# EAGLE design subway-timetable (EAGLE 7.7.0)
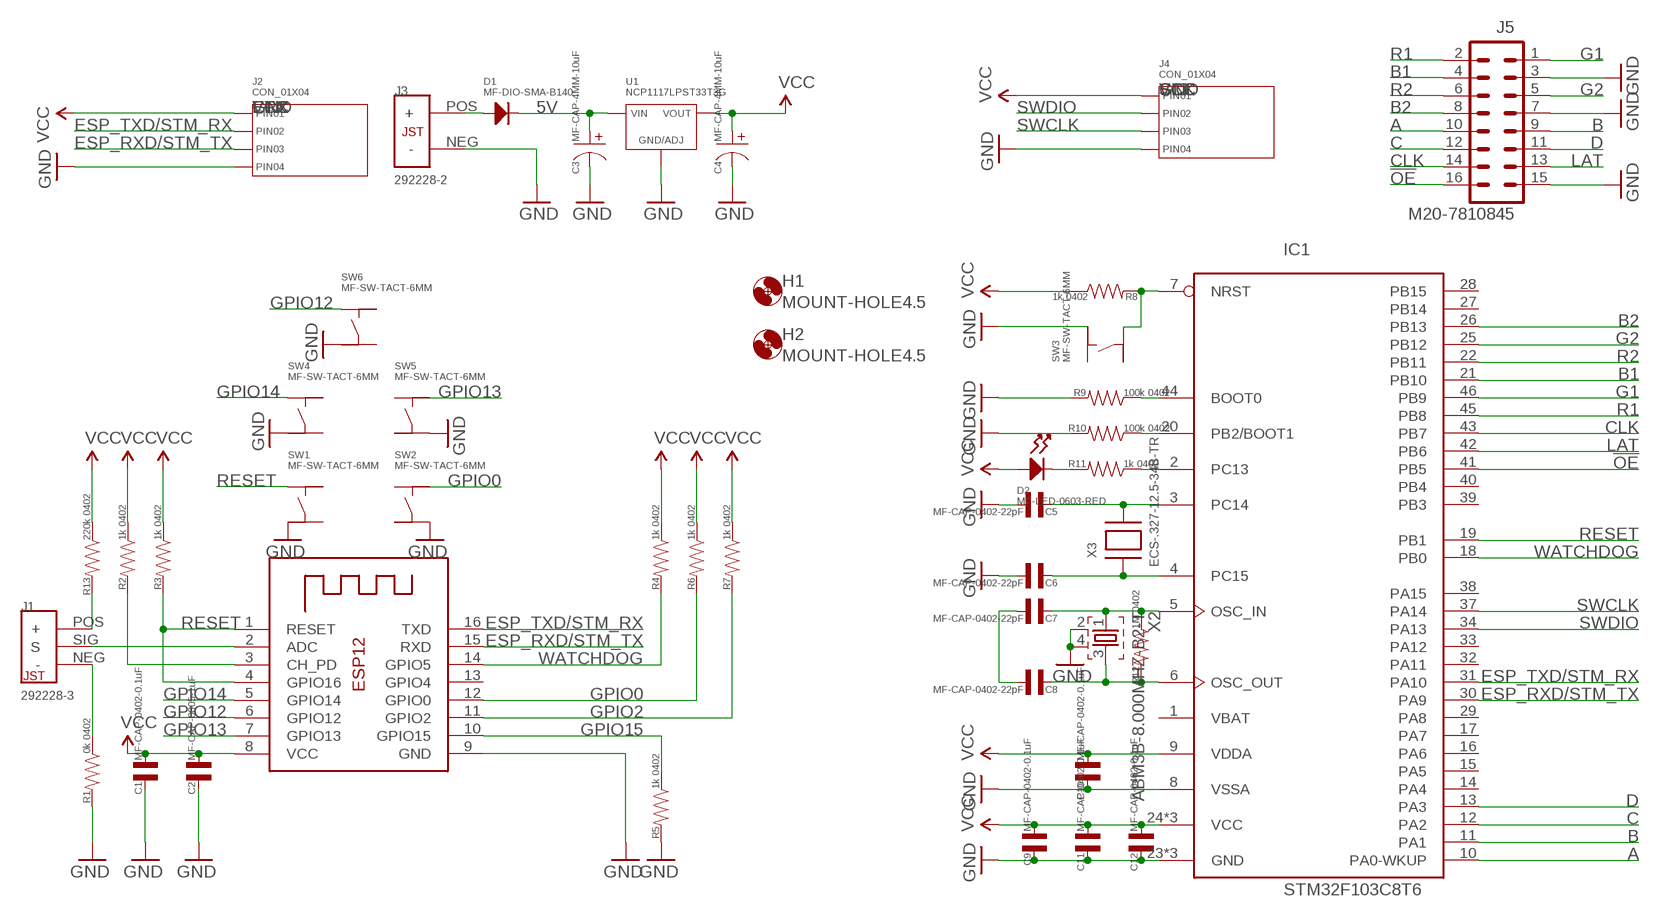
[diagram p0: schematic, sheet 1]

## Parts
C1  MF-CAP-0402-0.1uF  CAPACITOR_NP_0402  [C0402]
C2  MF-CAP-0805-1uF  CAPACITOR_NP_0805  [C0805]
C3  MF-CAP-4MM-10uF  CAPACITOR_P_4MM  [CP4MM]
C4  MF-CAP-4MM-10uF  CAPACITOR_P_4MM  [CP4MM]
C5  MF-CAP-0402-22pF  CAPACITOR_NP_0402  [C0402]
C6  MF-CAP-0402-22pF  CAPACITOR_NP_0402  [C0402]
C7  MF-CAP-0402-22pF  CAPACITOR_NP_0402  [C0402]
C8  MF-CAP-0402-22pF  CAPACITOR_NP_0402  [C0402]
C9  MF-CAP-0402-0.1uF  CAPACITOR_NP_0402  [C0402]
C10  MF-CAP-0402-0.1uF  CAPACITOR_NP_0402  [C0402]
C11  MF-CAP-0402-0.1uF  CAPACITOR_NP_0402  [C0402]
C12  MF-CAP-0402-0.1uF  CAPACITOR_NP_0402  [C0402]
D1  MF-DIO-SMA-B140  DIODES_B140_SMA  [SMA]
D2  MF-LED-0603-RED  LED_SINGLE-0603-RED  [LED0603]
H1  MOUNT-HOLE4.5  [4,5]
H2  MOUNT-HOLE4.5  [4,5]
IC1  STM32F103C8T6  STM32F103C8T  [LQFP48]
J1  292228-3  MINICT-3  [292228-3]
J2  CON_01X04  [PTH_2.54MM_01X04_SPECIAL]
J3  292228-2  MINICT  [292228-2]
J4  CON_01X04  [PTH_2.54MM_01X04_SPECIAL]
J5  M20-7810845  M08X2SMD  [2X8_SMD]
R1  0k 0402  RESISTOR_0402  [R0402]
R2  1k 0402  RESISTOR_0402  [R0402]
R3  1k 0402  RESISTOR_0402  [R0402]
R4  1k 0402  RESISTOR_0402  [R0402]
R5  1k 0402  RESISTOR_0402  [R0402]
R6  1k 0402  RESISTOR_0402  [R0402]
R7  1k 0402  RESISTOR_0402  [R0402]
R8  1k 0402  RESISTOR_0402  [R0402]
R9  100k 0402  RESISTOR_0402  [R0402]
R10  100k 0402  RESISTOR_0402  [R0402]
R11  1k 0402  RESISTOR_0402  [R0402]
R12  1M 0402  RESISTOR_0402  [R0402]
R13  220k 0402  RESISTOR_0402  [R0402]
SW1  MF-SW-TACT-6MM  TACT_6MM  [TACT6MM]
SW2  MF-SW-TACT-6MM  TACT_6MM  [TACT6MM]
SW3  MF-SW-TACT-6MM  TACT_6MM  [TACT6MM]
SW4  MF-SW-TACT-6MM  TACT_6MM  [TACT6MM]
SW5  MF-SW-TACT-6MM  TACT_6MM  [TACT6MM]
SW6  MF-SW-TACT-6MM  TACT_6MM  [TACT6MM]
U1  NCP1117LPST33T3G  [SOT-223-3]
X1  ESP-12  [ESP-12]
X2  ABM3B-8.000MHZ-B2-T  CRYSTALS-GND-LID-CFPX-104  [5.2X3.4-4-PAD]
X3  ECS-.327-12.5-34B-TR  XTAL-3.2X1.5  [XTAL3215]

## Nets
5V: C3.P$1 D1.CATHODE U1.P$4(VIN)
!OE: IC1.41(PB5) J5.16
A: IC1.10(PA0-WKUP) J5.10
B: IC1.11(PA1) J5.9
B1: IC1.21(PB10) J5.4
B2: IC1.26(PB13) J5.8
C: IC1.12(PA2) J5.12
CLK: IC1.43(PB7) J5.14
D: IC1.13(PA3) J5.11
ESP_RXD/STM_TX: IC1.30(PA9) J2.P$3(PIN3) X1.15(RXD)
ESP_TXD/STM_RX: IC1.31(PA10) J2.P$2(PIN2) X1.16(TXD)
G1: IC1.46(PB9) J5.1
G2: IC1.25(PB12) J5.5
GND [power]: C1.P$2 C2.P$2 C3.P$2 C4.P$2 C5.P$1 C6.P$1 C9.P$2 C10.P$2 C11.P$2 C12.P$2 IC1.8(VSSA) IC1.23(GND) IC1.35(GND) IC1.47(GND) J2.P$4(PIN4) J3.NEG(-) J4.P$4(PIN4) J5.3 J5.7 J5.15 R1.P$2 R5.P$2 R9.P$2 R10.P$2 SW1.P$3 SW2.P$4 SW3.P$2 SW4.P$3 SW5.P$4 SW6.P$3 U1.P$2(GND/ADJ) X1.9(GND) X2.2 X2.4
GPIO0: R6.P$2 SW2.P$2 X1.12(GPIO0)
GPIO2: R7.P$2 X1.11(GPIO2)
GPIO12: SW6.P$1 X1.6(GPIO12)
GPIO13: SW5.P$2 X1.7(GPIO13)
GPIO14: SW4.P$1 X1.5(GPIO14)
GPIO15: R5.P$1 X1.10(GPIO15)
LAT: IC1.42(PB6) J5.13
N$1: IC1.20(PB2/BOOT1) R10.P$1
N$2: R2.P$2 X1.3(CH_PD)
N$3: D2.CATHODE R11.P$2
N$4: IC1.7(NRST) R8.P$2 SW3.P$4
N$5: IC1.44(BOOT0) R9.P$1
N$6: J1.SIG(S) X1.2(ADC)
N$7: IC1.2(PC13) R11.P$1
N$8: C5.P$2 IC1.3(PC14) X3.P$2
N$9: C6.P$2 IC1.4(PC15) X3.P$1
N$10: C7.P$2 IC1.5(OSC_IN) R12.P$1 X2.1
N$11: C8.P$2 IC1.6(OSC_OUT) R12.P$2 X2.3
N$12: C7.P$1 C8.P$1
N$13: D1.ANODE J3.POS(+)
N$14: J1.NEG(-) R1.P$1
N$15: J1.POS(+) R13.P$2
R1: IC1.45(PB8) J5.2
R2: IC1.22(PB11) J5.6
RESET: IC1.19(PB1) R3.P$2 SW1.P$1 X1.1(RESET) X1.4(GPIO16)
SWCLK: IC1.37(PA14) J4.P$3(PIN3)
SWDIO: IC1.34(PA13) J4.P$2(PIN2)
VCC [power]: C1.P$1 C2.P$1 C4.P$1 C9.P$1 C10.P$1 C11.P$1 C12.P$1 D2.ANODE IC1.9(VDDA) IC1.24(VCC) IC1.36(VCC) IC1.48(VCC) J2.P$1(PIN1) J4.P$1(PIN1) R2.P$1 R3.P$1 R4.P$1 R6.P$1 R7.P$1 R8.P$1 R13.P$1 U1.P$1(VOUT) U1.P$3(VOUT) X1.8(VCC)
WATCHDOG: IC1.18(PB0) R4.P$2 X1.14(GPIO5)
Unconnected: IC1.14(PA4) IC1.15(PA5) IC1.16(PA6) IC1.17(PA7) IC1.27(PB14) IC1.28(PB15) IC1.29(PA8) IC1.32(PA11) IC1.33(PA12) IC1.38(PA15) IC1.39(PB3) IC1.40(PB4) SW1.P$2 SW1.P$4 SW2.P$1 SW2.P$3 SW3.P$1 SW3.P$3 SW4.P$2 SW4.P$4 SW5.P$1 SW5.P$3 SW6.P$2 SW6.P$4 X1.13(GPIO4)

## Power pins joined to a net without a drawn wire
VBAT: IC1.1(VBAT)

## Library data of the parts
C1 C2 C5-C12 = MF_Passives:CAPACITOR_NP: Library: MF_Passives Description: Device for Non-Polarized Capacitors. Manufacture part number (MPN) can be added via Attributes. Check https://factory.macrofab.com/parts for the house parts list.; POPULATE: 1
C3 C4 = MF_Passives:CAPACITOR_P: Library: MF_Passives Description: Device for Polarized Capacitors. Manufacture part number (MPN), Voltage Rating, and Tolerance can be added via Attributes. Check https://factory.macrofab.com/parts for the house parts list.; POPULATE: 1
D1 = MF_Discrete_Semiconductor:DIODES: Library: MF_Discrete_Semiconductor Description: Device for Single Packaged Diodes.; HOUSEPART: YES; MPN: MF-DIO-SMA-B140; POPULATE: 1; URL: https://factory.macrofab.com/part/MF-DIO-SMA-B140
D2 = MF_LEDs:LED_SINGLE: Library: MF_LEDs Description: Device for Single LED Packages. Manufacture part number (MFG#) can be added via Attributes.; HOUSEPART: YES; MPN: MF-LED-0603-RED; POPULATE: 1; URL: https://factory.macrofab.com/part/MF-LED-0603-RED
H1 H2 = holes:MOUNT-HOLE: MOUNTING HOLE with drill center marker
IC1 = micro-stm_v2:STM32F103C*T: ARM 32-bit Cortex™-M3 CPU 72 MHz maximum frequency 16 to 128 Kbytes of Flash memory 6 to 20 kbytes of SRAM 37 GPIOs 2.0 to 3.6 V application supply
J1 = sonik:MINICT-3
J2 = MF_Connectors:CON_01X04: Library: MF_Connectors Description: Header Connector with 04 Positions and 01 Rows. Use the LABEL Attribute to label the pin on the schematic and PCB. You can remove the attributes on the PCB by using the SMASH function on the part and then deleting the text.; LABEL01: VCC; LABEL02: ETX; LABEL03: ERX; LABEL04: GND
J3 = sonik:MINICT
J4 = MF_Connectors:CON_01X04: Library: MF_Connectors Description: Header Connector with 04 Positions and 01 Rows. Use the LABEL Attribute to label the pin on the schematic and PCB. You can remove the attributes on the PCB by using the SMASH function on the part and then deleting the text.; LABEL01: VCC; LABEL02: SIO; LABEL03: SCK; LABEL04: GND
J5 = SparkFun-Connectors:M08X2: .1" headers, two rows of 8 each
R1-R13 = MF_Passives:RESISTOR: Library: MF_Passives Description: Device for Resistors. Manufacture part number (MPN), Voltage, Tolerance, and Wattage Rating can be added via Attributes. Check https://factory.macrofab.com/parts for the house parts list.; POPULATE: 1
SW1-SW6 = MF_Switches:TACT: Library: MF_Switches Description: Device for Tact Switches. Manufacture part number (MFG#) can be added via Attributes.; HOUSEPART: YES; MPN: MF-SW-TACT-6MM; POPULATE: 1; URL: https://factory.macrofab.com/part/MF-SW-TACT-6MM
U1 = MF_IC_Power:NCP1117LP: Manufacturer Part #: NCP1117LP Manufacturer: ON Semiconductor Description: LDO Voltage Regulators; HOUSEPART: NO; MPN: NCP1117LPST33T3G; POPULATE: 1; URL: http://www.onsemi.com/pub_link/Collateral/NCP1117LP-D.PDF
X1 = adafruit:ESP-12
X2 = IQD-Frequency-Products:CRYSTALS-GND-LID: CRYSTALS WITH CAN GROUNDED
X3 = adafruit:XTAL: Low cost SMT crystals, no capacitors included http://www.ladyada.net/library/eagle

## Net classes
1 power: width 0.305 mm

## Board
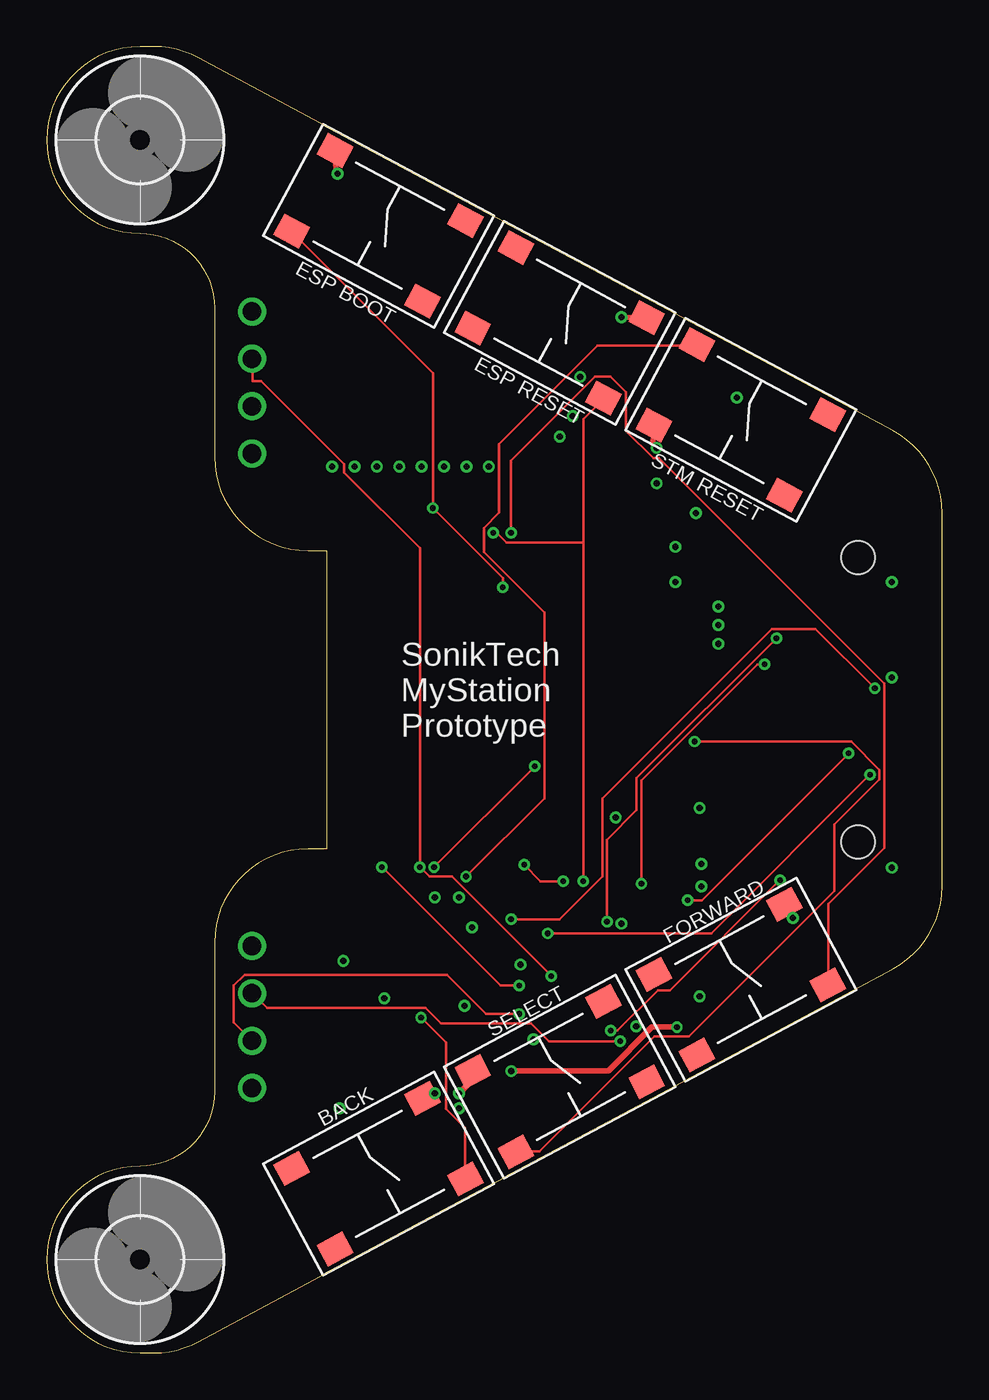
[diagram p1: board, top side]
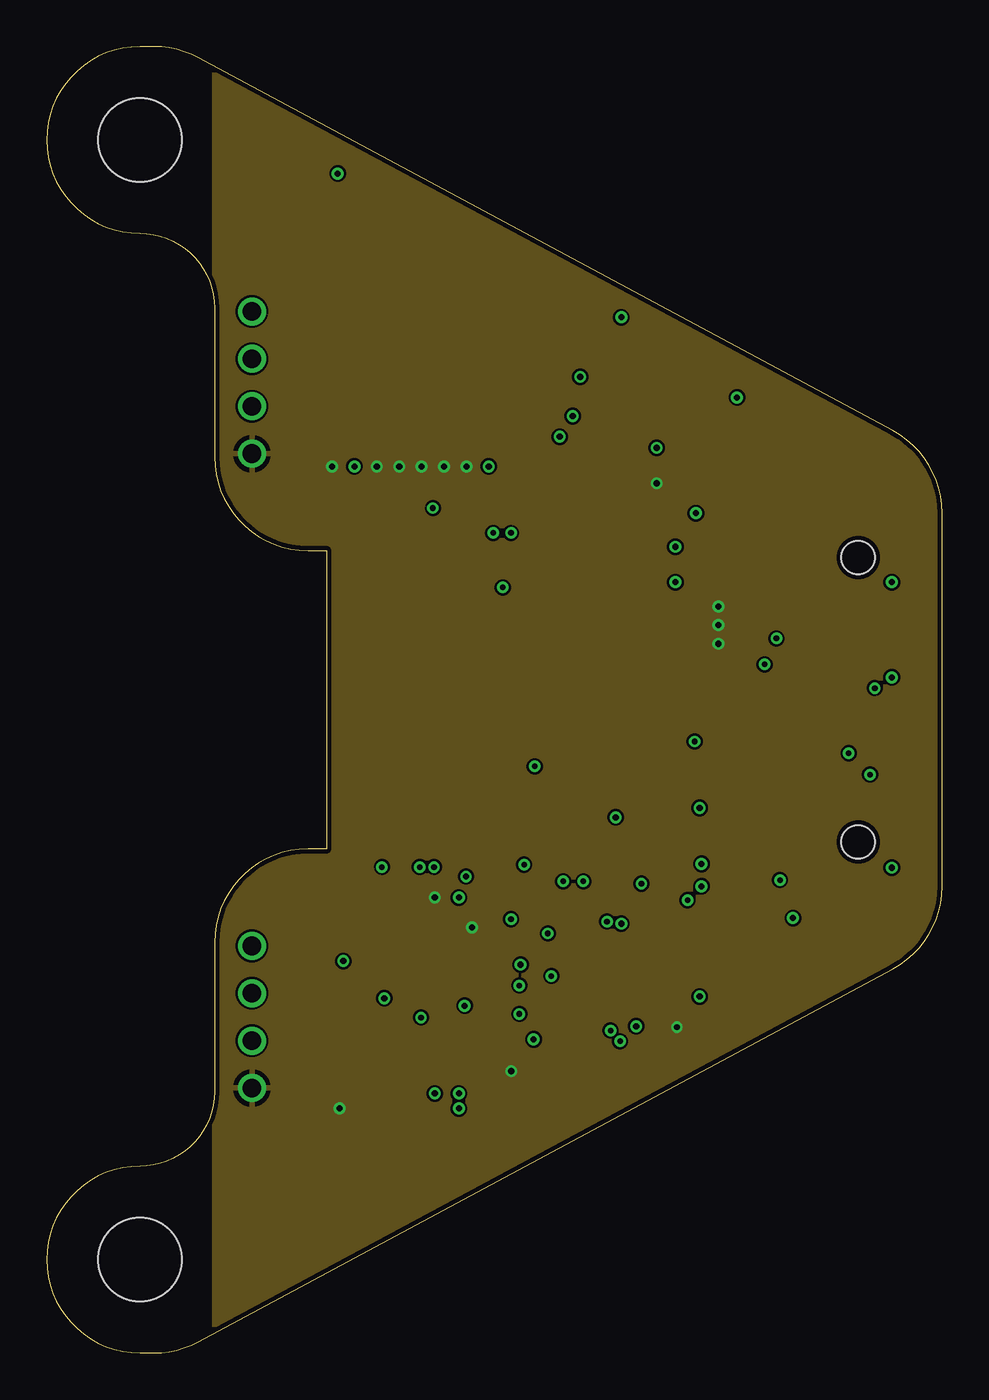
[diagram p2: board, inner layer VCC]
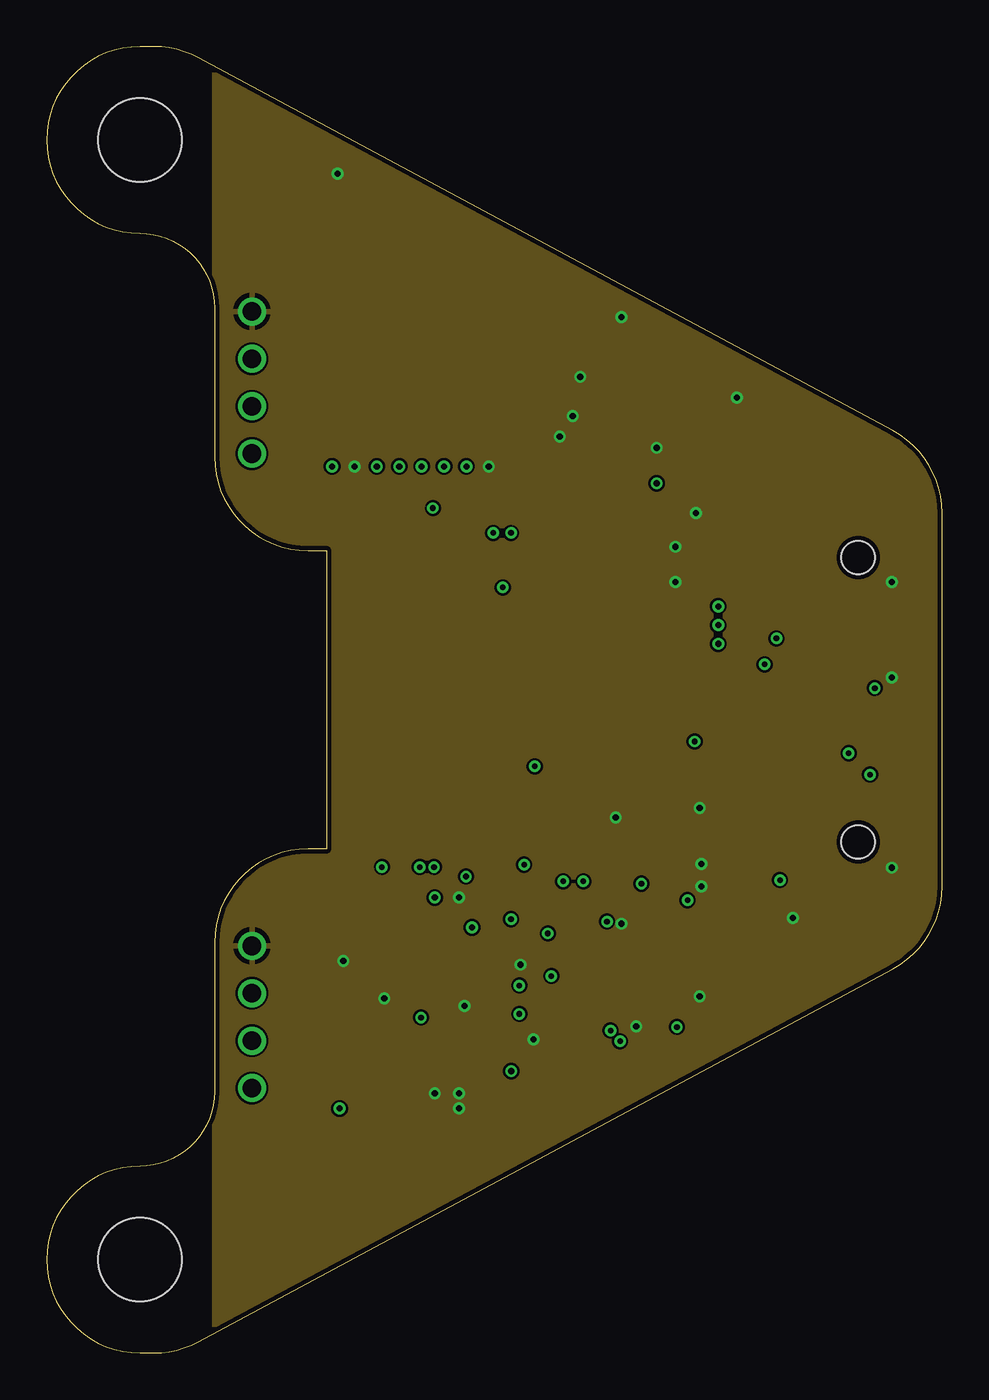
[diagram p3: board, inner layer GND]
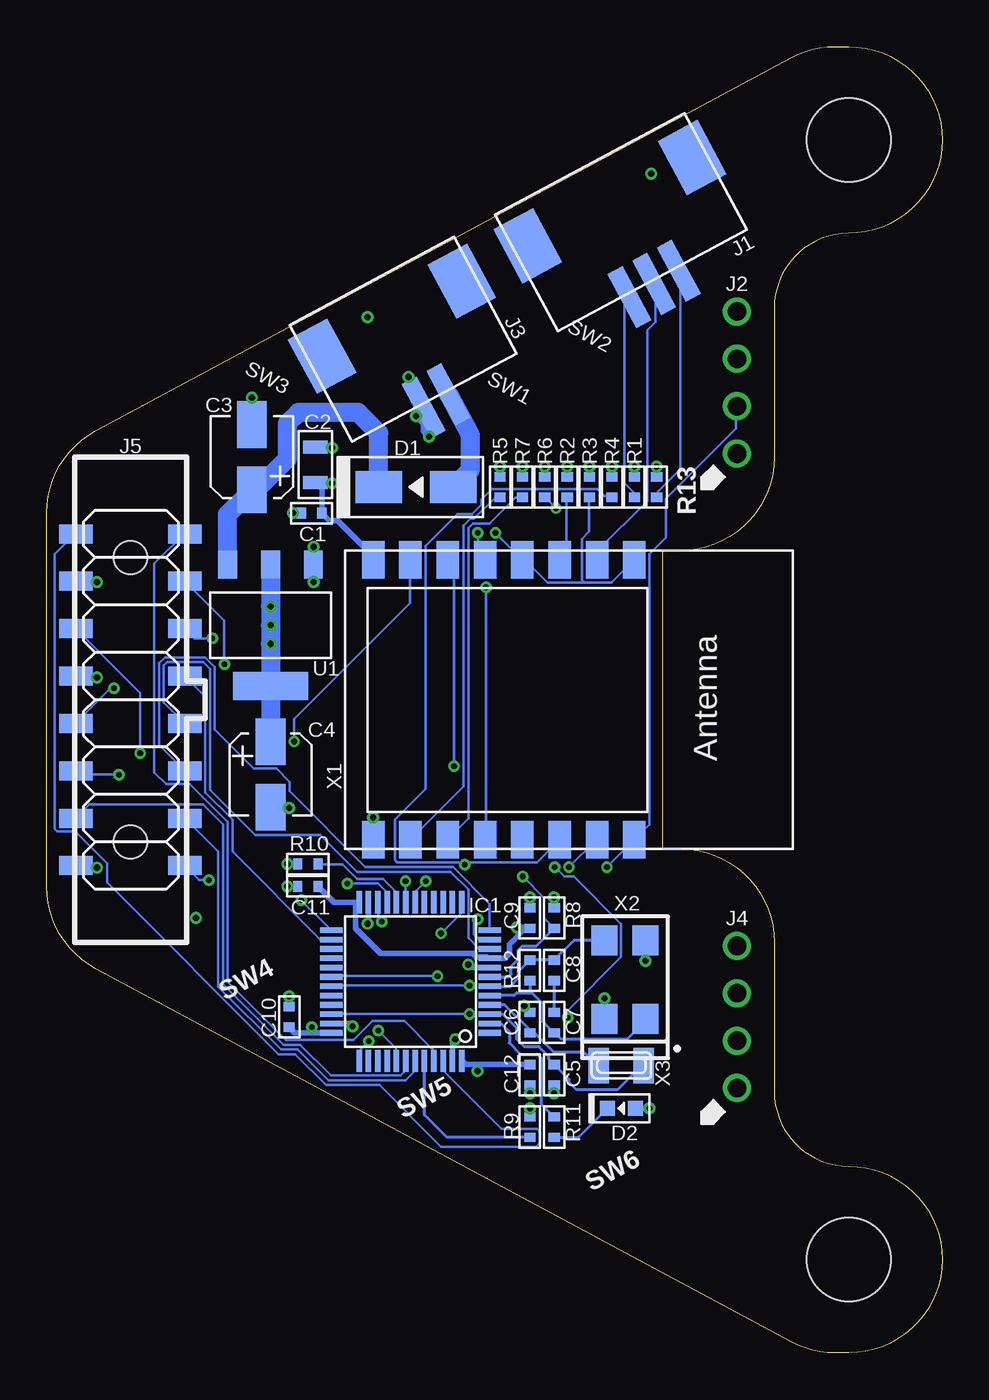
[diagram p4: board, bottom side, seen from below]

Size 48 x 70 mm. Coordinates in mm from the lower left corner, seen from the top.
Outline: 48,24.99 48,45.01 arc62 45.36,49.41 8.11,69.41 arc28 5.74,70 5,70 arc90 0,65 arc90 5,60 arc-90 9,56 9,48 arc90 14,43 15,43 15,27 14,27 arc90 9,22 9,14 arc-90 5,10 arc90 0,5 arc90 5,0 5.74,0 arc28 8.11,0.59 45.36,20.59 arc62 48,24.99
Copper layers (1*2*15*16): Top 0.035mm / dielectric 0.23mm / VCC 0.035mm / dielectric 0.93mm / GND 0.035mm / dielectric 0.23mm / Bottom 0.035mm
Design rules "MF_Standard_4_Layer": minimum track width 5mil, minimum drill 12mil, track to track 5mil, track to pad 5mil, pad to pad 5mil, via to via 5mil, smd to smd 0mil, copper to edge 10mil, drill to drill 10mil, minimum pad ring 6mil, minimum via ring 6mil, stop-mask expansion 2mil, vias tented up to drill 25mil, thermal gap 10mil

### Footprints (pad centres in the part's own frame; a part is rotated, then mirrored left to right if it is on the bottom)
C0402 = smd 0.5 x 0.6: P$1 -0.55,0; P$2 0.55,0
C0805 = smd 0.7 x 1.3: P$1 -0.95,0; P$2 0.95,0
CP4MM = smd 1.6 x 2.5: P$1 0,-1.75; P$2 0,1.75
SMA = smd 2.5 x 1.7: ANODE 2,0; CATHODE -2,0
LED0603 = smd 0.8 x 0.8: ANODE 0.75,0; CATHODE -0.75,0
4,5 = hole 4.5: 0,0
LQFP48 = smd 0.3 x 1.2: 1 -2.75,-4.25; 2 -2.25,-4.25; 3 -1.75,-4.25; 4 -1.25,-4.25; 5 -0.75,-4.25; 6 -0.25,-4.25; 7 0.25,-4.25; 8 0.75,-4.25; 9 1.25,-4.25; 10 1.75,-4.25; 11 2.25,-4.25; 12 2.75,-4.25; 25 2.75,4.25; 26 2.25,4.25; 27 1.75,4.25; 28 1.25,4.25; 29 0.75,4.25; 30 0.25,4.25; 31 -0.25,4.25; 32 -0.75,4.25; 33 -1.25,4.25; 34 -1.75,4.25; 35 -2.25,4.25; 36 -2.75,4.25 | smd 1.2 x 0.3: 13 4.25,-2.75; 14 4.25,-2.25; 15 4.25,-1.75; 16 4.25,-1.25; 17 4.25,-0.75; 18 4.25,-0.25; 19 4.25,0.25; 20 4.25,0.75; 21 4.25,1.25; 22 4.25,1.75; 23 4.25,2.25; 24 4.25,2.75; 37 -4.25,2.75; 38 -4.25,2.25; 39 -4.25,1.75; 40 -4.25,1.25; 41 -4.25,0.75; 42 -4.25,0.25; 43 -4.25,-0.25; 44 -4.25,-0.75; 45 -4.25,-1.25; 46 -4.25,-1.75; 47 -4.25,-2.25; 48 -4.25,-2.75
292228-3 = smd 0.9 x 3.3: NEG 1.5,4; POS -1.5,4; SIG 0,4 | smd 2.4 x 3.3: SLD1 -5,-1; SLD2 5,-1
PTH_2.54MM_01X04_SPECIAL = drill 1: P$1 -3.81,0; P$2 -1.27,0; P$3 1.27,0; P$4 3.81,0
292228-2 = smd 0.9 x 3.3: NEG 0.75,0; POS -0.75,0 | smd 2.4 x 3.3: SLD1 -4.25,-5; SLD2 4.25,-5
2X8_SMD = smd 1.02 x 1.78: 1 -8.89,-2.932; 2 -8.89,2.91; 3 -6.35,-2.932; 4 -6.35,2.91; 5 -3.81,-2.932; 6 -3.81,2.91; 7 -1.27,-2.932; 8 -1.27,2.91; 9 1.27,-2.932; 10 1.27,2.91; 11 3.81,-2.932; 12 3.81,2.91; 13 6.35,-2.932; 14 6.35,2.91; 15 8.89,-2.932; 16 8.89,2.91 | hole 1.8: -7.62,0; 7.62,0
R0402 = smd 0.5 x 0.6: P$1 -0.55,0; P$2 0.55,0
TACT6MM = smd 1.55 x 1.3: P$1 -3.975,2.45; P$2 3.975,2.45; P$3 -3.975,-2.45; P$4 3.975,-2.45
SOT-223-3 = smd 1.5 x 4: P$1 3.25,0 | smd 1.5 x 1: P$2 -3.25,2.3; P$3 -3.25,0; P$4 -3.25,-2.3
ESP-12 = smd 2 x 1.2: 1 -7.5,4.5; 2 -7.5,2.5; 3 -7.5,0.5; 4 -7.5,-1.5; 5 -7.5,-3.5; 6 -7.5,-5.5; 7 -7.5,-7.5; 8 -7.5,-9.5; 9 7.5,-9.5; 10 7.5,-7.5; 11 7.5,-5.5; 12 7.5,-3.5; 13 7.5,-1.5; 14 7.5,0.5; 15 7.5,2.5; 16 7.5,4.5
5.2X3.4-4-PAD = smd 1.6 x 1.4: 1 -2.1,-1.1; 2 2.1,-1.1; 3 2.1,1.1; 4 -2.1,1.1
XTAL3215 = smd 1.1 x 1.9: P$1 1.2,0; P$2 -1.2,0

### Placement (x,y rotation side)
C1  33.8,45 180 bottom
C2  33.6,47.6 90 bottom
C3  37,48 0 bottom
C4  36,31 180 bottom
C5  20.8,14.9 90 bottom
C6  22.1,17.7 270 bottom
C7  20.8,17.7 270 bottom
C8  20.8,20.5 90 bottom
C9  22.1,23.3 90 bottom
C10  35,18 90 bottom
C11  34,25 180 bottom
C12  22.1,14.9 270 bottom
D1  28.2,46.4 0 bottom
D2  17.2,13.1 0 bottom
H1  5,5 0 top
H2  5,65 0 top
IC1  28.5,19.9 90 bottom
J1  17.33,60.81 208.2 bottom
J2  11,52 90 top
J3  27.13,51.02 208.2 bottom
J4  11,18 90 top
J5  43.5,35 270 bottom
R1  16.5,46.4 90 bottom
R2  20.1,46.4 270 bottom
R3  18.9,46.4 270 bottom
R4  17.7,46.4 270 bottom
R5  23.7,46.4 90 bottom
R6  21.3,46.4 270 bottom
R7  22.5,46.4 270 bottom
R8  20.8,23.3 270 bottom
R9  22.1,12.1 90 bottom
R10  34,26.2 180 bottom
R11  20.8,12.1 270 bottom
R12  22.1,20.5 90 bottom
R13  15.3,46.4 270 bottom
SW1  27.5,55.2 151.8 top
SW2  17.8,60.4 151.8 top
SW3  37.2,50 151.8 top
SW4  37.2,20 208.2 top
SW5  27.5,14.8 208.2 top
SW6  17.8,9.6 208.2 top
U1  36,39 270 bottom
X1  21,35 270 bottom
X2  17,20 90 bottom
X3  17.2,15.4 180 bottom

### Tracks (layer width: path | path; a pad name or v marks a point on that pad's centre or on a via)
5V
  Bottom 1.016: D1.CATHODE 30.2,49.3 31.3,50.4 34.5,50.4 35.1,49.8 35.1,47.9 36.4,46.6 36.65,46.6 C3.P$1 38.3,44.95 U1.P$4
!OE  (via drill 0.3)
  Top 0.127: v30.23,17.27 30.61,17.27 32.77,19.43 33.4,19.43 v39.31,25.34
  Bottom 0.127: v30.23,17.27 29.27,16.32 29.27,15.68 IC1.41 | v39.31,25.34 39.81,25.34 40.58,26.1 J5.16
A
  Bottom 0.127: IC1.10 24.83,21.65 25.4,22.23 25.4,24.83 26.35,25.78 31.37,25.78 33.34,27.75 36.83,27.75 39.24,30.16 39.24,36.64 39.62,37.02 41.53,37.02 41.72,36.83 41.72,34.86 40.64,33.78 J5.10
B  (via drill 0.3)
  Top 0.127: v24.89,23.24 27.5,23.24 29.78,25.53 29.78,29.72 38.86,38.8 41.21,38.8 v44.39,35.62
  Bottom 0.127: v24.89,23.24 25.08,23.05 25.08,22.42 24.83,22.16 24.26,22.16 IC1.11 | v44.39,35.62 44.58,35.62 46.42,33.78 J5.9
B1  (via drill 0.3)
  Top 0.127: v31.88,25.15 31.88,30.67 38.1,36.89 v38.48,36.89
  Bottom 0.127: v31.88,25.15 30.23,25.15 29.78,24.7 29.78,24.19 IC1.21 | v38.48,36.89 38.48,39.24 40.58,41.34 J5.4
B2
  Bottom 0.127: IC1.26 32.77,22.16 33.34,22.16 38.04,26.86 38.04,28.57 39.5,30.04 39.5,35.18 40.58,36.26 J5.8
C
  Bottom 0.127: IC1.12 24.26,22.67 24.26,24.07 26.23,26.04 30.92,26.04 34.99,30.1 34.99,30.61 35.69,31.3 36.89,31.3 38.99,33.4 38.99,36.77 39.5,37.27 41.66,37.27 41.97,36.96 41.97,32.58 40.64,31.24 J5.12
CLK
  Bottom 0.127: IC1.43 28.26,15.62 28.26,15.11 28.77,14.61 32.89,14.61 34.54,16.26 35.43,16.26 38.8,19.62 38.8,26.86 40.58,28.64 J5.14
D  (via drill 0.3)
  Top 0.127: v26.86,22.48 35.62,22.48 v44.13,30.99
  Bottom 0.127: v26.86,22.48 25.78,23.56 25.78,24.13 IC1.13 | v44.13,30.99 46.23,30.99 46.42,31.18 J5.11
ESP_RXD/STM_TX  (via drill 0.3)
  Top 0.127: v27.05,20.19 21.72,25.53 20.51,25.53 v20,26.04 20,43.12 15.94,47.18 15.94,47.62 11.49,52.07 11.05,52.07 11.05,53.21 J2.P$3
  Bottom 0.127: v27.05,20.19 32.7,20.19 IC1.30 | v20,26.04 18.54,27.5 X1.15
ESP_TXD/STM_RX  (via drill 0.3)
  Top 0.127: v25.34,19.68 24.32,19.68 v17.97,26.04
  Bottom 0.127: v25.34,19.68 32.7,19.68 IC1.31 | v17.97,26.04 X1.16 16.45,27.56 15.68,28.32 15.68,42.8 14.8,43.69 14.8,45.78 11.05,49.53 11.05,50.67 J2.P$2
G1
  Bottom 0.127: IC1.46 26.73,15.62 26.73,15.11 23.62,12 21.72,12 21.59,11.87 21.59,11.24 21.78,11.05 26.86,11.05 30.16,14.35 33.02,14.35 34.67,16 35.56,16 44.77,25.21 44.77,26.23 46.48,27.94 47.43,27.94 47.56,28.07 47.56,42.8 46.48,43.88 J5.1
G2  (via drill 0.3)
  Top 0.127: v34.35,24.26 35.12,24.26 v42.99,32.13
  Bottom 0.127: v34.35,24.26 32.77,22.67 IC1.25 | v42.99,32.13 42.99,35.37 46.42,38.8 J5.5
GND  (via drill 0.33)
  Top 0.305: SW3.P$2 32.5,48.7 v32.7,48.5 | SW1.P$3 v30.8,55.5 | SW2.P$4 15.52,63.28 v15.6,63.2 | SW5.P$4 22.84,14.64 v22.1,13.9 | SW6.P$3 20.54,13.64 v20.8,13.9 | SW4.P$3 39.55,23.75 v40,23.3
  Bottom 0.305: C3.P$2 v37,51.2 | C2.P$2 32.85,48.55 v32.7,48.5 | U1.P$2 v33.7,41.3 v33.7,43.2 | C1.P$2 v34.8,45 | J3.NEG 27.79,49.39 v27.5,49.1 27.5,49.5 v28.2,50.2 28.2,50.8 v28.6,52.3 | R1.P$2 v16.5,47.5 | R5.P$2 v23.7,47.5 | C4.P$2 35.05,29.25 v35,29.2 | J5.3 45.35,41.35 v45.3,41.3 | J5.7 45.37,36.27 v45.3,36.2 | J5.15 45.31,26.11 v45.3,26 | R10.P$2 v35.1,26.2 | C11.P$2 v35.1,25 | C10.P$2 v35,19.1 | IC1.35 31.75,17.65 v31.6,17.5 | IC1.47 26.25,16.65 v26.1,16.8 | IC1.8 25.25,20.65 v25.4,20.8 | C12.P$2 v22.1,13.9 | R9.P$2 v22.1,13.1 | C5.P$1 v20.8,13.9 | C6.P$1 22.15,18.25 v22.4,18.6 | X2.4 v18.1,19 | X2.2 v15.9,21 | C9.P$2 v22.1,24.4 | IC1.23 30.75,23.05 v30.8,23 | X1.9 v30.5,28.7
  pour GND: 9,70 48,70 48,0 9,0
GPIO0  (via drill 0.3)
  Top 0.127: SW2.P$2 13.14,60.07 20.7,52.51 v20.7,45.28 24.45,41.53 v24.45,41.02
  Bottom 0.127: v20.7,45.28 21.27,45.85 R6.P$2 | v24.45,41.02 24.45,27.56 X1.12
GPIO2
  Bottom 0.127: R7.P$2 22.54,45.85 22.86,45.85 24.26,44.45 25.15,44.45 25.4,44.2 25.4,28.64 26.48,27.56 X1.11
GPIO12  (via drill 0.3)
  Top 0.127: v20.07,17.97 21.4,16.64 21.4,13.08 22.42,12.06 22.42,9.34 SW6.P$1 | v26.16,31.43 v20.77,26.04
  Bottom 0.127: v20.07,17.97 20.07,18.35 17.21,21.21 17.21,22.99 19.75,25.53 20.26,25.53 v20.77,26.04 | v26.16,31.43 26.16,42.16 26.48,42.48 X1.6
GPIO13  (via drill 0.3)
  Top 0.127: v34.73,32.77 43.12,32.77 44.64,31.24 44.64,30.73 42.23,28.32 42.23,24.77 34.42,16.95 32.58,16.95 26.42,10.79 25.21,10.79 SW5.P$2
  Bottom 0.127: v34.73,32.77 34.73,33.97 28.51,40.2 28.51,42.48 X1.7
GPIO14  (via drill 0.3)
  Top 0.127: v24.89,43.94 24.89,47.82 29.4,52.32 30.23,52.32 31.05,51.5 31.05,49.4 32.51,47.94 32.83,47.94 44.9,35.88 44.9,27.05 41.91,24.07 41.91,19.75 SW4.P$1
  Bottom 0.127: v24.89,43.94 24.89,42.93 24.51,42.55 X1.5
GPIO15
  Bottom 0.127: R5.P$1 23.75,45.85 23.94,45.85 25.08,44.7 25.27,44.7 25.65,44.32 25.65,30.35 28.45,27.56 X1.10
LAT
  Bottom 0.127: IC1.42 28.77,15.62 28.77,15.11 29.02,14.86 32.77,14.86 34.42,16.51 35.31,16.51 38.54,19.75 38.54,28.32 39.62,29.4 45.72,29.4 46.42,28.7 J5.13
N$1
  Bottom 0.127: R10.P$1 33.4,26.16 32.13,26.16 31.37,25.4 29.97,25.4 29.27,24.7 29.27,24.19 IC1.20
N$2
  Bottom 0.127: R2.P$2 20.13,45.85 20.13,42.86 20.45,42.55 X1.3
N$3
  Bottom 0.152: R11.P$2 19.5,11.55 D2.CATHODE
N$4  (via drill 0.3)
  Top 0.127: v22.48,25.53 26.67,29.72 26.67,39.69 23.43,42.93 23.43,44.2 24.26,45.02 24.26,48.7 29.53,53.98 34.8,53.98 SW3.P$4
  Bottom 0.127: v22.48,25.53 21.34,24.38 21.34,23.3 20.83,22.8 R8.P$2
  Bottom 0.152: IC1.7 23.25,20.15 23.1,20.3 23.1,20.7 22.7,21.1 22.7,21.6 22.5,21.8 21.75,21.8 R8.P$2
N$5
  Bottom 0.152: R9.P$1 26.55,11.55 27.75,12.75 IC1.44
N$6
  Bottom 0.127: 18.48,42.99 18.48,42.55 X1.2 18.48,42.99 | 15.37,57.21 15.43,57.28 J1.SIG 15.37,57.21 | 18.48,42.99 15.81,45.66 15.81,54.8 15.37,55.24 15.37,57.21
N$7
  Bottom 0.152: IC1.2 23.65,17.65 23.2,17.2 23.2,16.6 22.6,16 21.7,16 21.5,15.8 21.5,13.35 R11.P$1
N$8
  Bottom 0.152: X3.P$2 16.5,15 17.4,14.1 19.6,14.1 20,14.5 20,14.65 C5.P$2 | C5.P$2 20.95,15.45 | IC1.3 23.55,18.15 22.8,17.4 22.8,16.8 22.4,16.4 21.6,16.4 21.1,15.9 21.1,15.75 C5.P$2
N$9
  Bottom 0.152: X3.P$1 19.2,16.1 20.8,16.1 21.85,17.15 C6.P$2 22.1,17.3 23.45,18.65 IC1.4
N$10
  Bottom 0.152: X2.1 16.1,17.6 16.9,16.8 20.4,16.8 20.6,17 20.65,17 C7.P$2 21.4,17.75 21.4,18.7 22,19.3 22.1,19.3 | 22.1,19.3 22.8,19.3 22.95,19.15 IC1.5 | R12.P$1 22.1,19.3
N$11
  Bottom 0.152: X2.3 19.75,22.1 C8.P$2 R12.P$2 22.7,20.45 22.7,20.1 23.15,19.65 IC1.6
N$12
  Bottom 0.152: C8.P$1 C7.P$1
N$13
  Bottom 1.016: J3.POS 25.3,49.2 25.3,47.3 D1.ANODE
N$14
  Bottom 0.127: R1.P$1 16.51,45.91 16.51,46.1 17.02,46.61 17.02,56.26 16.76,56.52 J1.NEG
N$15
  Bottom 0.127: R13.P$2 15.24,45.91 15.24,46.16 14.03,47.37 14.03,57.91 14.1,57.98 J1.POS
R1
  Bottom 0.127: IC1.45 27.3,15.68 27.3,16.26 28.83,17.78 30.54,17.78 31.56,16.76 35.18,16.76 38.29,19.88 38.29,28.45 40.32,30.48 41.59,30.48 42.23,31.11 42.23,42.29 40.64,43.88 J5.2
R2  (via drill 0.3)
  Top 0.127: v30.04,23.11 30.04,27.5 31.62,29.08 31.62,30.8 v39.12,38.29
  Bottom 0.127: v30.04,23.11 30.23,23.3 30.23,24.13 IC1.22 | v39.12,38.29 40.07,38.29 40.58,38.8 J5.6
RESET  (via drill 0.3)
  Top 0.127: 28.77,43.43 28.77,50.04 29.84,51.12 SW1.P$1 | 28.77,43.43 v28.77,25.27 | v23.94,43.94 24.13,43.94 24.64,43.43 28.77,43.43
  Bottom 0.127: 19.21,41.31 19.18,41.27 17.72,41.27 16.51,42.48 X1.1 | 19.21,41.31 19.3,41.4 19.3,43.62 18.92,44.01 18.92,45.85 R3.P$2 | 19.21,41.31 19.24,41.27 21.14,41.27 22.35,42.48 22.48,42.48 X1.4 22.54,42.55 v23.94,43.94 | v28.77,25.27 28.77,24.19 IC1.19
SWCLK  (via drill 0.3)
  Top 0.127: v30.73,16.7 26.92,16.7 25.97,17.65 21.14,17.65 20.32,18.48 11.81,18.48 11.05,19.24 J4.P$3
  Bottom 0.127: v30.73,16.7 31.24,16.19 31.24,15.68 IC1.37
SWDIO  (via drill 0.3)
  Top 0.127: v25.34,18.16 23.56,18.16 21.46,20.26 10.6,20.26 10.03,19.68 10.03,17.72 10.99,16.76 J4.P$2
  Bottom 0.127: v25.34,18.16 32.7,18.16 IC1.34
VCC  (via drill 0.3, 0.33)
  Top 0.305: v33.78,17.46 32.45,17.46 30.1,15.11 24.96,15.11 v24.9,15.1
  Bottom 0.305: v32.7,46.6 32.75,46.65 C2.P$1 33.25,46.3 C1.P$1 32.85,44.6 32.4,44.6 30.5,42.7 X1.8 | R4.P$1 v17.7,47.5 | R3.P$1 v18.9,47.5 | R2.P$1 v20.1,47.5 | R6.P$1 v21.3,47.5 | R7.P$1 v22.5,47.5 | IC1.36 33.78,17.15 | 33.78,17.15 34.7,17.15 C10.P$1 | IC1.48 25.55,15.45 25,15.45 | 25,15.45 C12.P$1 22.25,15.45 | D2.ANODE v15.7,13.1 | v24.9,15.1 24.9,15.35 25,15.45 | R8.P$1 v20.8,24.4 | v22.8,22.8 22.15,22.8 C9.P$1 22.35,22.75 23.2,21.9 23.2,21.4 23.45,21.15 IC1.9 24.38,21.21 24.96,21.21 25.15,21.4 30.1,21.4 31.43,22.73 31.43,24.15 | IC1.24 31.43,24.15 | 31.43,24.15 32.6,24.15 C11.P$1 | v33.78,17.46 33.78,17.15 | R13.P$1 v15.3,47.5
  Bottom 1.016: C4.P$1 U1.P$1 v36,38 v36,39 v36,40 U1.P$3
  pour VCC: 9,70 48,70 48,0 9,0
WATCHDOG  (via drill 0.3)
  Top 0.127: v27.69,25.27 26.48,25.27 v25.59,26.16
  Bottom 0.127: 25.59,26.29 21.72,26.29 X1.14 | 25.59,26.29 29.21,26.29 29.34,26.42 29.34,28.57 27.69,30.23 27.69,43.24 25.97,44.96 25.21,44.96 24.7,45.47 24.7,45.72 24.13,46.29 18.48,46.29 18.1,45.91 17.72,45.91 R4.P$2 | v27.69,25.27 28.19,24.77 28.19,24.19 IC1.18 | 25.59,26.29 v25.59,26.16

### Text on the board
tNames: ESP BOOT | ESP RESET | STM RESET | SonikTech / MyStation / Prototype | FORWARD | SELECT | BACK